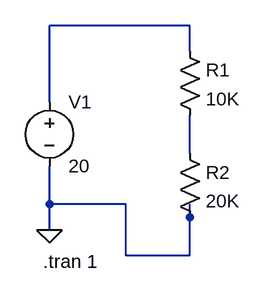
[diagram p0: schematic voltage divider.asc]
voltage divider.asc, the LTspice schematic file:
Version 4
SHEET 1 880 680
WIRE 80 -96 -96 -96
WIRE 80 -64 80 -96
WIRE -96 0 -96 -96
WIRE 80 64 80 16
WIRE -96 128 -96 80
WIRE 0 128 -96 128
WIRE 80 144 80 128
WIRE -96 160 -96 128
WIRE 0 192 0 128
WIRE 80 192 80 144
WIRE 80 192 0 192
FLAG -96 160 0
SYMBOL res 64 -80 R0
SYMATTR InstName R1
SYMATTR Value 10K
SYMBOL res 64 48 R0
SYMATTR InstName R2
SYMATTR Value 20K
SYMBOL voltage -96 -16 R0
WINDOW 123 0 0 Left 0
WINDOW 39 0 0 Left 0
SYMATTR InstName V1
SYMATTR Value 20
TEXT -104 200 Left 2 !.tran 1

The netlist it stands for:
* voltage divider.asc
R1 N001 N002 10K
R2 N002 0 20K
V1 N001 0 20
.tran 1
.backanno
.end